# Altium schematic sheet ADC-Z-DOK.SchDoc: <SPECIFIC SHEET FUNCTION>
size A3; Date: DO NOT USE, RATHER USE PROJ OPTIONS; DrawnBy: DO NOT USE, RATHER USE PROJ OPTIONS; Engineer: DO NOT USE, RATHER USE PROJ OPTIONS; Organization: DO NOT USE, RATHER USE PROJ OPTIONS; DocumentNumber: 6; Revision: DO NOT USE, RATHER USE PROJ OPTIONS; SheetNumber: 2; SheetTotal: 12; SCH_Sheet_Filename: ADC-Z-DOK.SchDoc; CurrentTime: DO NOT USE, RATHER USE PROJ OPTIONS; Time: DO NOT USE, RATHER USE PROJ OPTIONS; DocumentFullPathAndName: DO NOT USE, RATHER USE PROJ OPTIONS; DocumentName: DO NOT USE, RATHER USE PROJ OPTIONS; ModifiedDate: DO NOT USE, RATHER USE PROJ OPTIONS; ImagePath: DO NOT USE, RATHER USE PROJ OPTIONS
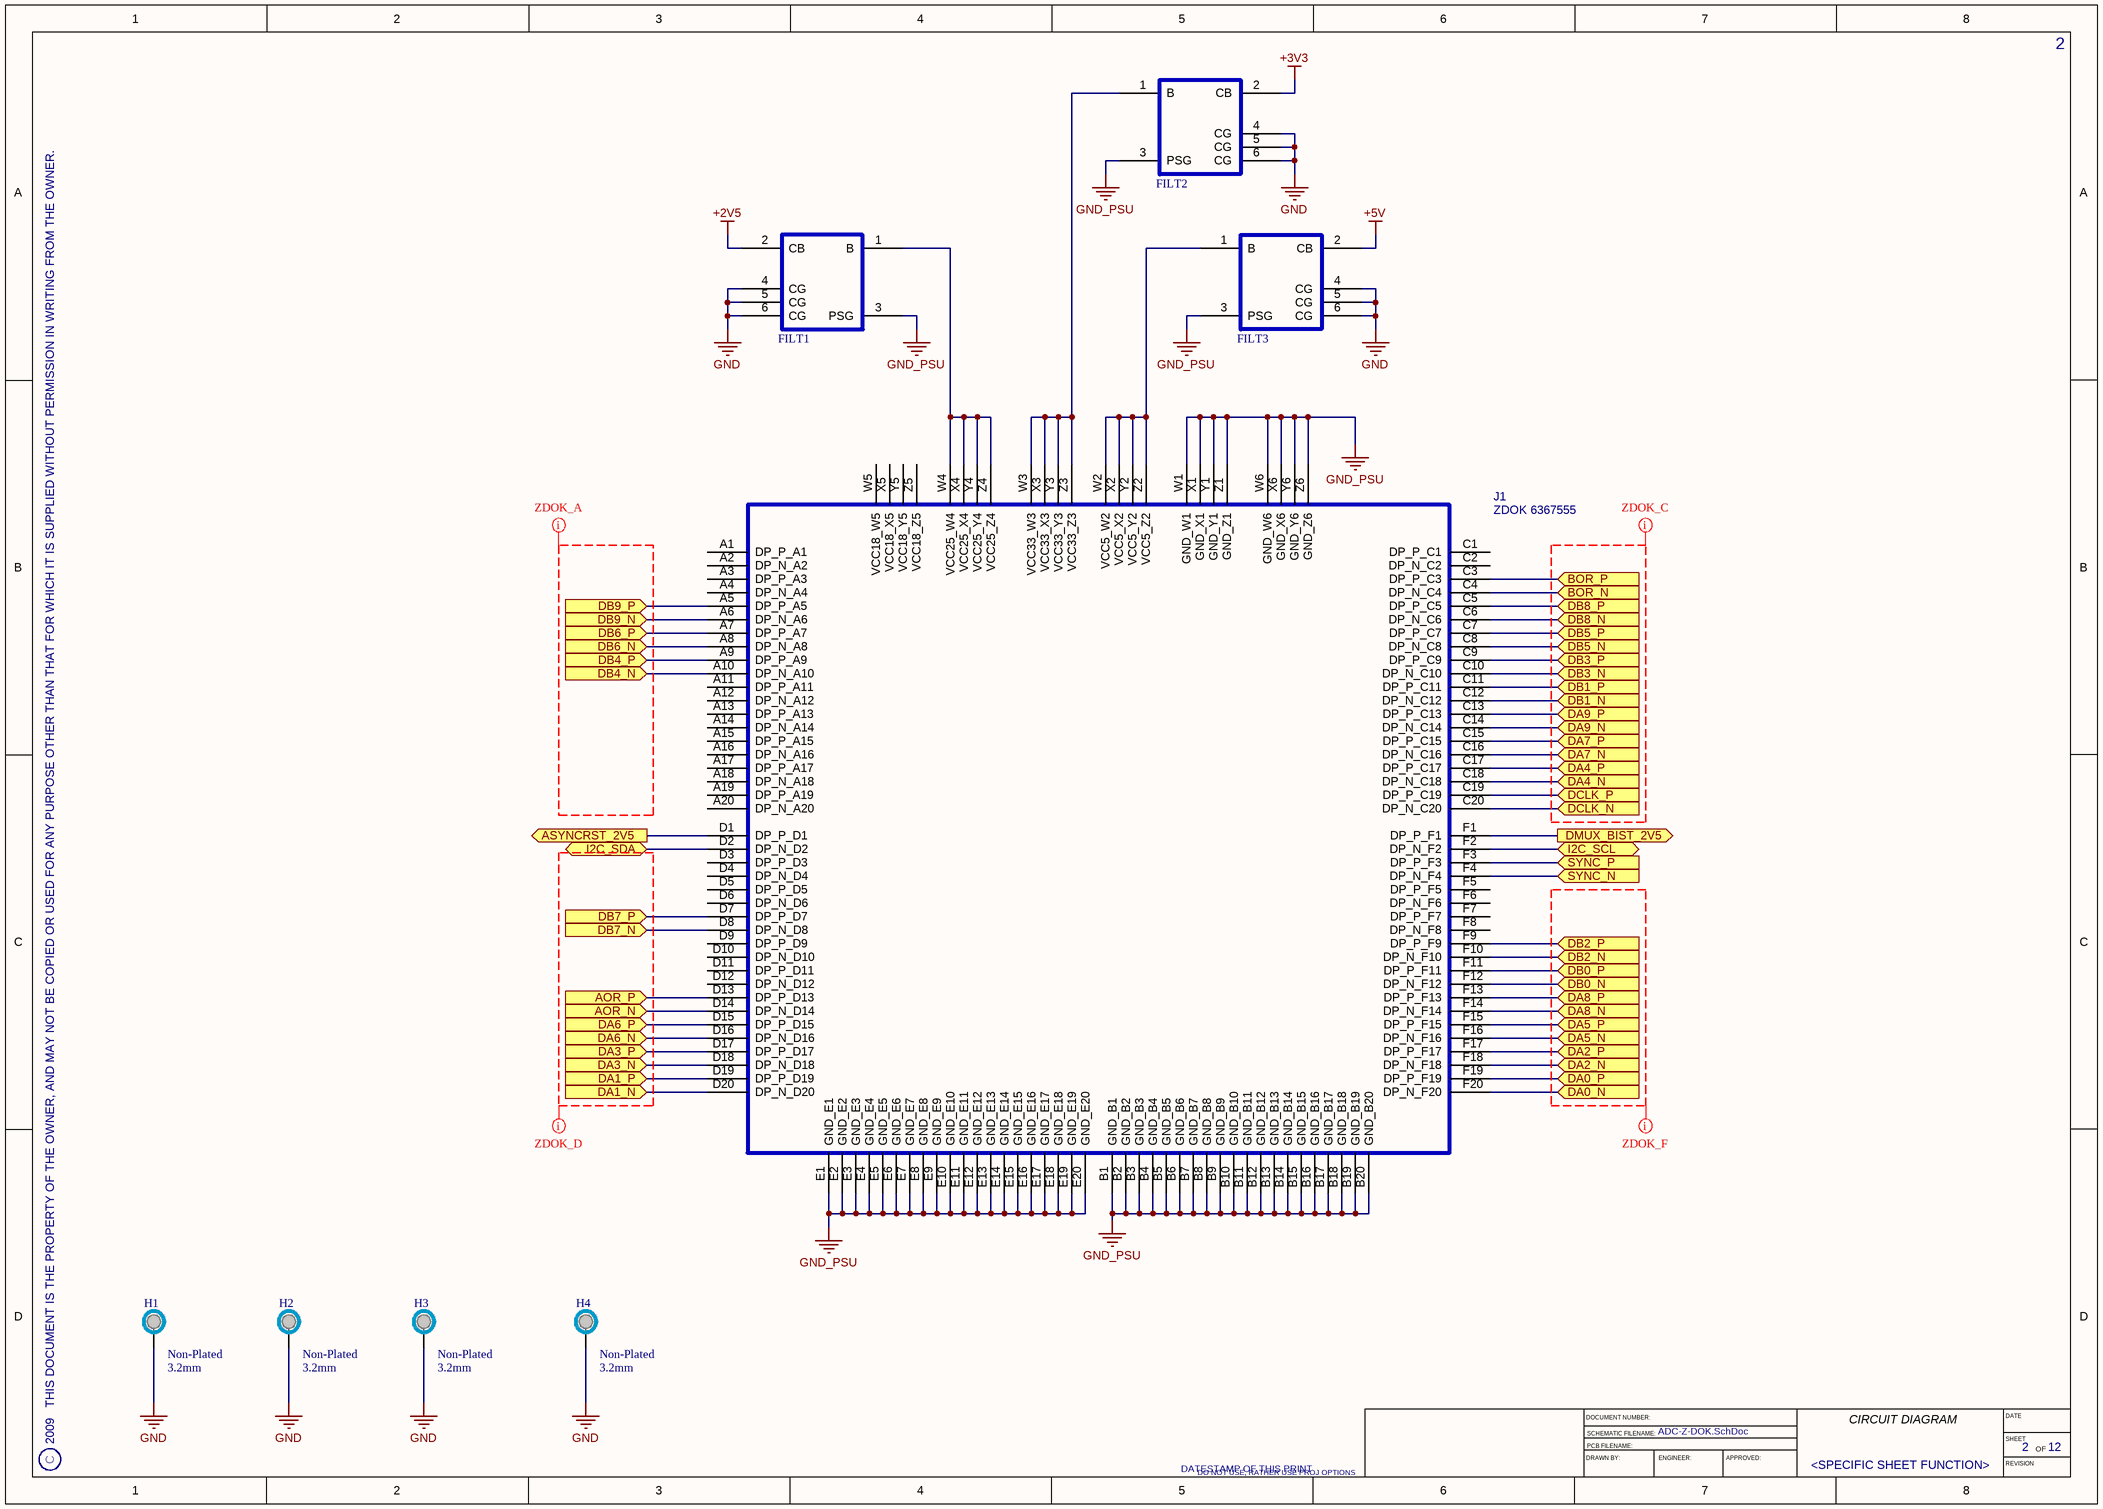
[diagram p0: ADC-Z-DOK.SchDoc]

## Parts
FILT1  BNX002-01  [BNX002-01]  (value not drawn)
FILT2  BNX002-01  [BNX002-01]  (value not drawn)
FILT3  BNX002-01  [BNX002-01]  (value not drawn)
H1  Non-Plated  HoleDia: 3.2mm  [HOLE]  (no BOM)
H2  Non-Plated  HoleDia: 3.2mm  [HOLE]  (no BOM)
H3  Non-Plated  HoleDia: 3.2mm  [HOLE]  (no BOM)
H4  Non-Plated  HoleDia: 3.2mm  [HOLE]  (no BOM)
J1  Z-DOK  [TYCO6367555]  (value not drawn)

## Ports
AOR_N (in), AOR_P (in), ASYNCRST_2V5 (out), BOR_N (in), BOR_P (in), DA0_N (in), DA0_P (in), DA1_N (in), DA1_P (in), DA2_N (in), DA2_P (in), DA3_N (in), DA3_P (in), DA4_N (in), DA4_P (in), DA5_N (in), DA5_P (in), DA6_N (in), DA6_P (in), DA7_N (in), DA7_P (in), DA8_N (in), DA8_P (in), DA9_N (in), DA9_P (in), DB0_N (in), DB0_P (in), DB1_N (in), DB1_P (in), DB2_N (in), DB2_P (in), DB3_N (in), DB3_P (in), DB4_N (in), DB4_P (in), DB5_N (in), DB5_P (in), DB6_N (in), DB6_P (in), DB7_N (in), DB7_P (in), DB8_N (in), DB8_P (in), DB9_N (in), DB9_P (in), DCLK_N (in), DCLK_P (in), DMUX_BIST_2V5 (out), I2C_SCL (bidir), I2C_SDA (bidir), SYNC_N (in), SYNC_P (in)

## Nets
+2V5: FILT1.2(CB)
+3V3: FILT2.2(CB)
+5V: FILT3.2(CB)
GND: FILT1.4(CG) FILT1.5(CG) FILT1.6(CG) FILT2.4(CG) FILT2.5(CG) FILT2.6(CG) FILT3.4(CG) FILT3.5(CG) FILT3.6(CG) H1.1(TP) H2.1(TP) H3.1(TP) H4.1(TP)
GND_PSU: FILT1.3(PSG) FILT2.3(PSG) FILT3.3(PSG) J1.B1(GND_B1) J1.B2(GND_B2) J1.B3(GND_B3) J1.B4(GND_B4) J1.B5(GND_B5) J1.B6(GND_B6) J1.B7(GND_B7) J1.B8(GND_B8) J1.B9(GND_B9) J1.B10(GND_B10) J1.B11(GND_B11) J1.B12(GND_B12) J1.B13(GND_B13) J1.B14(GND_B14) J1.B15(GND_B15) J1.B16(GND_B16) J1.B17(GND_B17) J1.B18(GND_B18) J1.B19(GND_B19) J1.B20(GND_B20) J1.E1(GND_E1) J1.E2(GND_E2) J1.E3(GND_E3) J1.E4(GND_E4) J1.E5(GND_E5) J1.E6(GND_E6) J1.E7(GND_E7) J1.E8(GND_E8) J1.E9(GND_E9) J1.E10(GND_E10) J1.E11(GND_E11) J1.E12(GND_E12) J1.E13(GND_E13) J1.E14(GND_E14) J1.E15(GND_E15) J1.E16(GND_E16) J1.E17(GND_E17) J1.E18(GND_E18) J1.E19(GND_E19) J1.E20(GND_E20) J1.W1(GND_W1) J1.W6(GND_W6) J1.X1(GND_X1) J1.X6(GND_X6) J1.Y1(GND_Y1) J1.Y6(GND_Y6) J1.Z1(GND_Z1) J1.Z6(GND_Z6)
AOR_N: J1.D14(DP_N_D14) ; port AOR_N
AOR_P: J1.D13(DP_P_D13) ; port AOR_P
ASYNCRST_2V5: J1.D1(DP_P_D1) ; port ASYNCRST_2V5
BOR_N: J1.C4(DP_N_C4) ; port BOR_N
BOR_P: J1.C3(DP_P_C3) ; port BOR_P
DA0_N: J1.F20(DP_N_F20) ; port DA0_N
DA0_P: J1.F19(DP_P_F19) ; port DA0_P
DA1_N: J1.D20(DP_N_D20) ; port DA1_N
DA1_P: J1.D19(DP_P_D19) ; port DA1_P
DA2_N: J1.F18(DP_N_F18) ; port DA2_N
DA2_P: J1.F17(DP_P_F17) ; port DA2_P
DA3_N: J1.D18(DP_N_D18) ; port DA3_N
DA3_P: J1.D17(DP_P_D17) ; port DA3_P
DA4_N: J1.C18(DP_N_C18) ; port DA4_N
DA4_P: J1.C17(DP_P_C17) ; port DA4_P
DA5_N: J1.F16(DP_N_F16) ; port DA5_N
DA5_P: J1.F15(DP_P_F15) ; port DA5_P
DA6_N: J1.D16(DP_N_D16) ; port DA6_N
DA6_P: J1.D15(DP_P_D15) ; port DA6_P
DA7_N: J1.C16(DP_N_C16) ; port DA7_N
DA7_P: J1.C15(DP_P_C15) ; port DA7_P
DA8_N: J1.F14(DP_N_F14) ; port DA8_N
DA8_P: J1.F13(DP_P_F13) ; port DA8_P
DA9_N: J1.C14(DP_N_C14) ; port DA9_N
DA9_P: J1.C13(DP_P_C13) ; port DA9_P
DB0_N: J1.F12(DP_N_F12) ; port DB0_N
DB0_P: J1.F11(DP_P_F11) ; port DB0_P
DB1_N: J1.C12(DP_N_C12) ; port DB1_N
DB1_P: J1.C11(DP_P_C11) ; port DB1_P
DB2_N: J1.F10(DP_N_F10) ; port DB2_N
DB2_P: J1.F9(DP_P_F9) ; port DB2_P
DB3_N: J1.C10(DP_N_C10) ; port DB3_N
DB3_P: J1.C9(DP_P_C9) ; port DB3_P
DB4_N: J1.A10(DP_N_A10) ; port DB4_N
DB4_P: J1.A9(DP_P_A9) ; port DB4_P
DB5_N: J1.C8(DP_N_C8) ; port DB5_N
DB5_P: J1.C7(DP_P_C7) ; port DB5_P
DB6_N: J1.A8(DP_N_A8) ; port DB6_N
DB6_P: J1.A7(DP_P_A7) ; port DB6_P
DB7_N: J1.D8(DP_N_D8) ; port DB7_N
DB7_P: J1.D7(DP_P_D7) ; port DB7_P
DB8_N: J1.C6(DP_N_C6) ; port DB8_N
DB8_P: J1.C5(DP_P_C5) ; port DB8_P
DB9_N: J1.A6(DP_N_A6) ; port DB9_N
DB9_P: J1.A5(DP_P_A5) ; port DB9_P
DCLK_N: J1.C20(DP_N_C20) ; port DCLK_N
DCLK_P: J1.C19(DP_P_C19) ; port DCLK_P
DMUX_BIST_2V5: J1.F1(DP_P_F1) ; port DMUX_BIST_2V5
I2C_SCL: J1.F2(DP_N_F2) ; port I2C_SCL
I2C_SDA: J1.D2(DP_N_D2) ; port I2C_SDA
SYNC_N: J1.F4(DP_N_F4) ; port SYNC_N
SYNC_P: J1.F3(DP_P_F3) ; port SYNC_P
NetFILT1_1: FILT1.1(B) J1.W4(VCC25_W4) J1.X4(VCC25_X4) J1.Y4(VCC25_Y4) J1.Z4(VCC25_Z4)
NetFILT2_1: FILT2.1(B) J1.W3(VCC33_W3) J1.X3(VCC33_X3) J1.Y3(VCC33_Y3) J1.Z3(VCC33_Z3)
NetFILT3_1: FILT3.1(B) J1.W2(VCC5_W2) J1.X2(VCC5_X2) J1.Y2(VCC5_Y2) J1.Z2(VCC5_Z2)

Not connected (* = marked no-connect by the designer): J1 A1(DP_P_A1) A2(DP_N_A2) A3(DP_P_A3) A4(DP_N_A4) A11(DP_P_A11) A12(DP_N_A12) A13(DP_P_A13) A14(DP_N_A14) A15(DP_P_A15) A16(DP_N_A16) A17(DP_P_A17) A18(DP_N_A18) A19(DP_P_A19) A20(DP_N_A20) C1(DP_P_C1) C2(DP_N_C2) D3(DP_P_D3) D4(DP_N_D4) D5(DP_P_D5) D6(DP_N_D6) D9(DP_P_D9) D10(DP_N_D10) D11(DP_P_D11) D12(DP_N_D12) F5(DP_P_F5) F6(DP_N_F6) F7(DP_P_F7) F8(DP_N_F8) W5(VCC18_W5) X5(VCC18_X5) Y5(VCC18_Y5) Z5(VCC18_Z5)

## Layout directives
net class ZDOK_A: (no net found under the mark)
net class ZDOK_D: (no net found under the mark)
net class ZDOK_C: (no net found under the mark)
net class ZDOK_F: (no net found under the mark)

## Notes on the sheet
- 2009   THIS DOCUMENT IS THE PROPERTY OF THE OWNER, AND MAY NOT BE COPIED OR USED FOR ANY PURPOSE OTHER THAN THAT FOR WHICH IT IS SUPPLIED WITHOUT PERMISSION IN WRITING FROM THE OWNER.
- C
- DATESTAMP OF THIS PRINT
- DRAWN BY:
- DOCUMENT NUMBER:
- SCHEMATIC FILENAME:
- PCB FILENAME:
- ENGINEER:
- APPROVED:
- CIRCUIT DIAGRAM
- DATE
- SHEET
- REVISION
- OF

## Library data of the parts
H1-H4 = Unplated Hole_3.2mm: PCB Mounting Hole; Category: Mounting Hole
J1 = ZDOK 6367555: Created_By: CT; Manufacturer: Z-DOK; Checked_By: *; Checked_Date: *; HelpURL: ENG_CS_1773095_Backplane_Connectors_Z-DOK_1208.pdf; ComponentLink1Description: Footprint Detail; ComponentLink1URL: ENG_CS_1773095_Backplane_Connectors_Z-DOK_1208.pdf#page=4; ComponentLink2Description: Application Note; ComponentLink2URL: *; ComponentLink3Description: Layout Guidelines; ComponentLink3URL: *; ComponentLink4Description: Technology Reference; ComponentLink4URL: *; Supplier1: *; Supplier2: *; Unit_Cost: *; MOQ: *; Leadtime: *; Inventory_Stock: *; Tolerance: *; Wattage: *; Package: *; ComponentLink5Description: Production Detail; ComponentLink5URL: *; Note: *; Stock Code: *; Manufacturer_PN: ZDOK 6367555
FILT1-FILT3 = BNX002-01: Checked_By: *; Checked_Date: *; HelpURL: *; Supplier1: *; Supplier2: *; Unit_Cost: *; MOQ: *; Leadtime: *; Inventory_Stock: *; Tolerance: *; Wattage: *; Package: BNX002-01; ComponentLinked1Description: *; ComponentLinked1URL: *; ComponentLinked2Description: *; ComponentLinked2URL: *; ComponentLinked3Description: *; ComponentLinked3URL: *; ComponentLinked4Description: *; ComponentLinked4URL: *